# EAGLE design display (EAGLE 9.6.2)
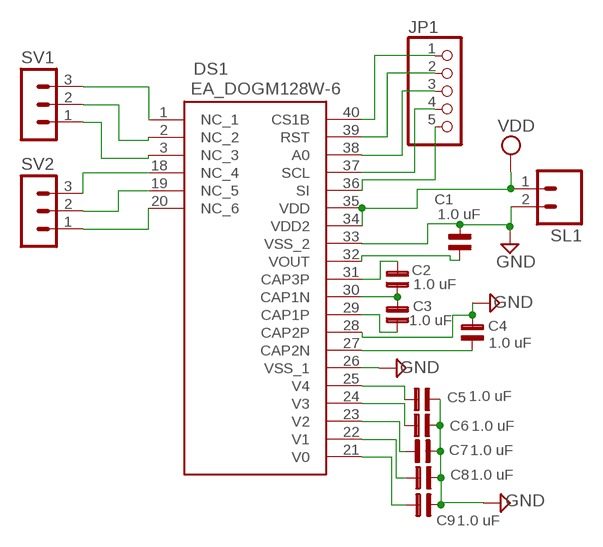
[diagram p0: schematic, sheet 1]

## Parts
C1  1.0 uF  C0805  [0805]
C2  1.0 uF  C0805  [0805]
C3  1.0 uF  C0805  [0805]
C4  1.0 uF  C0805  [0805]
C5  1.0 uF  C0805  [0805]
C6  1.0 uF  C0805  [0805]
C7  1.0 uF  C0805  [0805]
C8  1.0 uF  C0805  [0805]
C9  1.0 uF  C0805  [0805]
DS1  EA_DOGM128W-6  [EADOGM128W6]
JP1  PINHD-1X5  [1X05]
SL1  M02  [02P]
SV1  MA03-1  [MA03-1]
SV2  MA03-1  [MA03-1]

## Nets
GND: C1.2 C4.2 C5.2 C6.2 C7.2 C8.2 C9.2 DS1.26(VSS_1) DS1.28(CAP2P) DS1.33(VSS_2) SL1.2
N$1: C2.1 C3.2 DS1.30(CAP1N)
N$2: C2.2 DS1.31(CAP3P)
N$3: C3.1 DS1.29(CAP1P)
N$4: DS1.36(SI) JP1.5
N$5: C4.1 DS1.27(CAP2N)
N$6: C5.1 DS1.25(V4)
N$7: C6.1 DS1.24(V3)
N$8: C7.1 DS1.23(V2)
N$9: C8.1 DS1.22(V1)
N$10: C9.1 DS1.21(V0)
N$11: DS1.20(NC_6) SV2.1
N$12: DS1.19(NC_5) SV2.2
N$13: C1.1 DS1.32(VOUT)
N$14: DS1.18(NC_4) SV2.3
N$15: DS1.3(NC_3) SV1.1
N$16: DS1.2(NC_2) SV1.2
N$17: DS1.1(NC_1) SV1.3
N$18: DS1.37(SCL) JP1.4
N$19: DS1.38(A0) JP1.3
N$20: DS1.39(RST) JP1.2
N$21: DS1.40(CS1B) JP1.1
VDD: DS1.34(VDD2) DS1.35(VDD) SL1.1

## Library data of the parts
C1-C9 = capsmd:C0805
DS1 = SamacSys_Parts:EA_DOGM128W-6: Electronic Assembly EA DOGM128W-6 Graphic LCD Display, White on Black, Transflective Source: Datasheet <https://www.lcd-module.de/eng/pdf/grafik/dogm128e.pdf>; ARROW_PART_NUMBER: EA DOGM128W-6; DESCRIPTION: Electronic Assembly EA DOGM128W-6 Graphic LCD Display, White on Black, Transflective; HEIGHT: 2mm; MANUFACTURER_NAME: ELECTRONIC ASSEMBLY; MANUFACTURER_PART_NUMBER: EA DOGM128W-6; MOUSER_PART_NUMBER: 790-EADOGM128W6; MOUSER_PRICE-STOCK: https://www.mouser.co.uk/ProductDetail/ELECTRONIC-ASSEMBLY/EA-DOGM128W-6?qs=s9z6UkyjM7q3gza1hen1CQ%3D%3D
JP1 = pinhead:PINHD-1X5: PIN HEADER
SL1 = con-amp-quick:M02: AMP QUICK CONNECTOR; OC_FARNELL: unknown; OC_NEWARK: unknown
SV1 SV2 = con-lstb:MA03-1: PIN HEADER; OC_FARNELL: unknown; OC_NEWARK: unknown

## Board
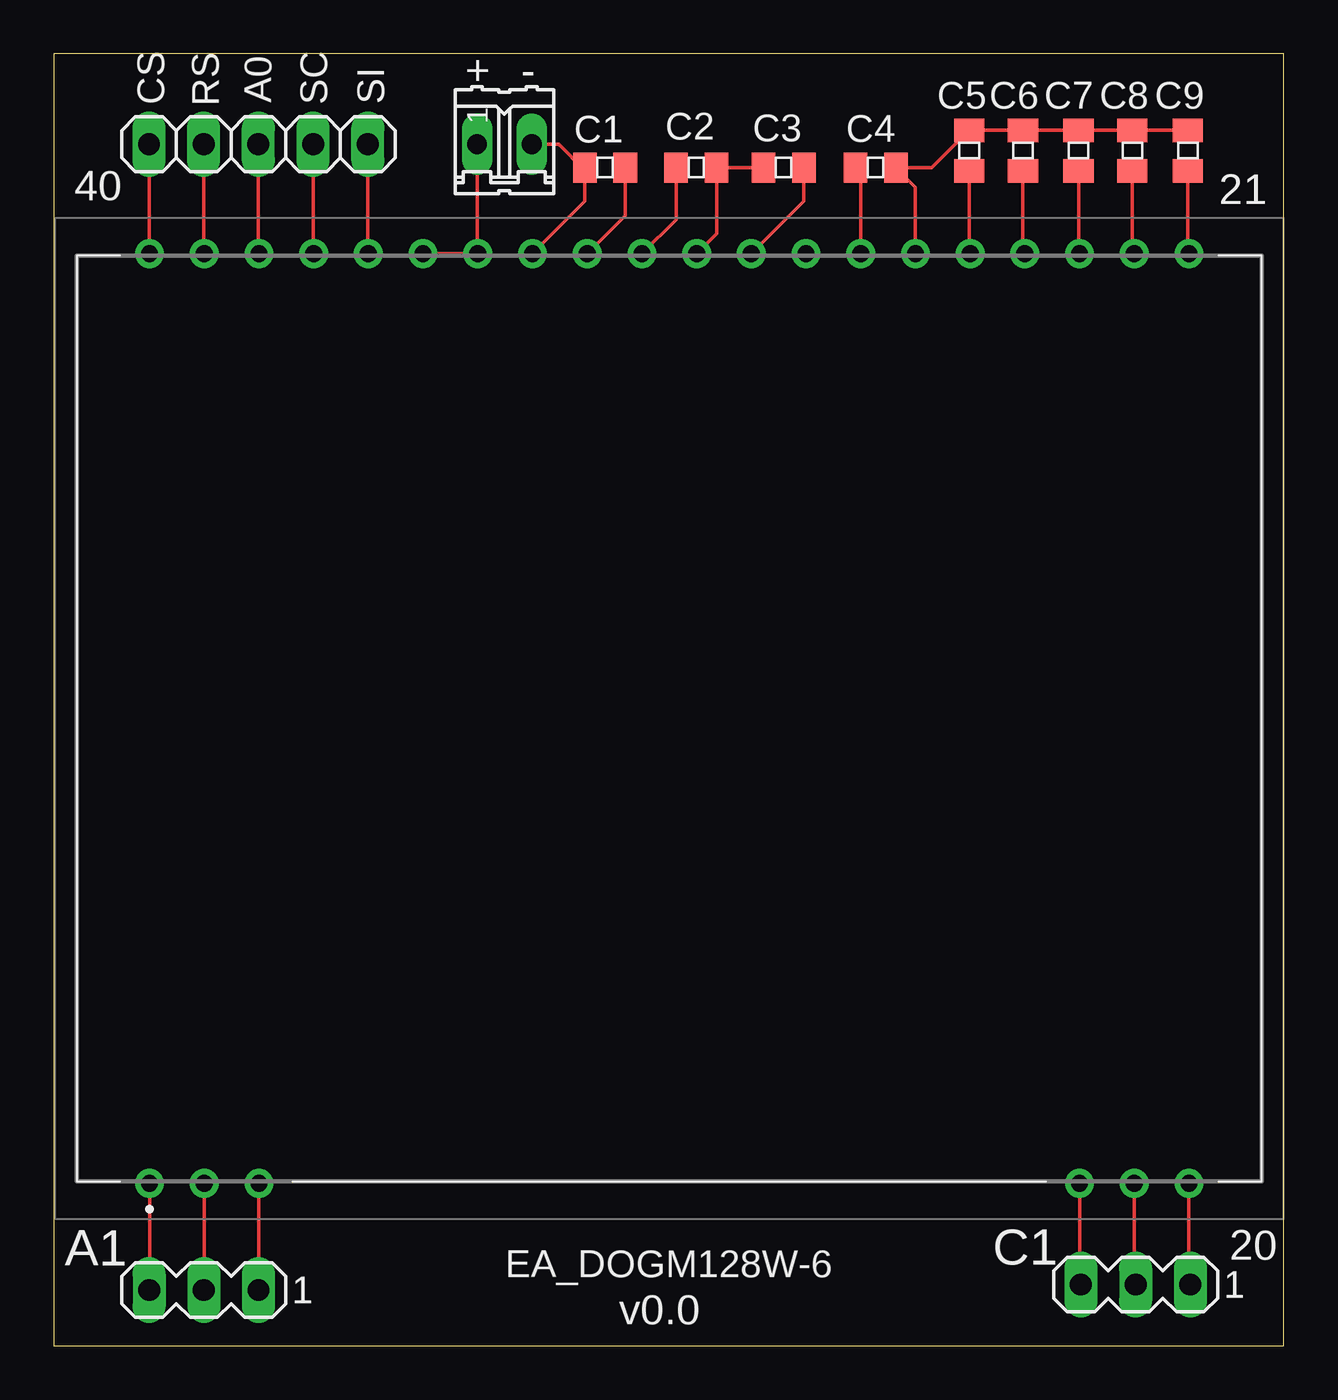
[diagram p1: board, top side]
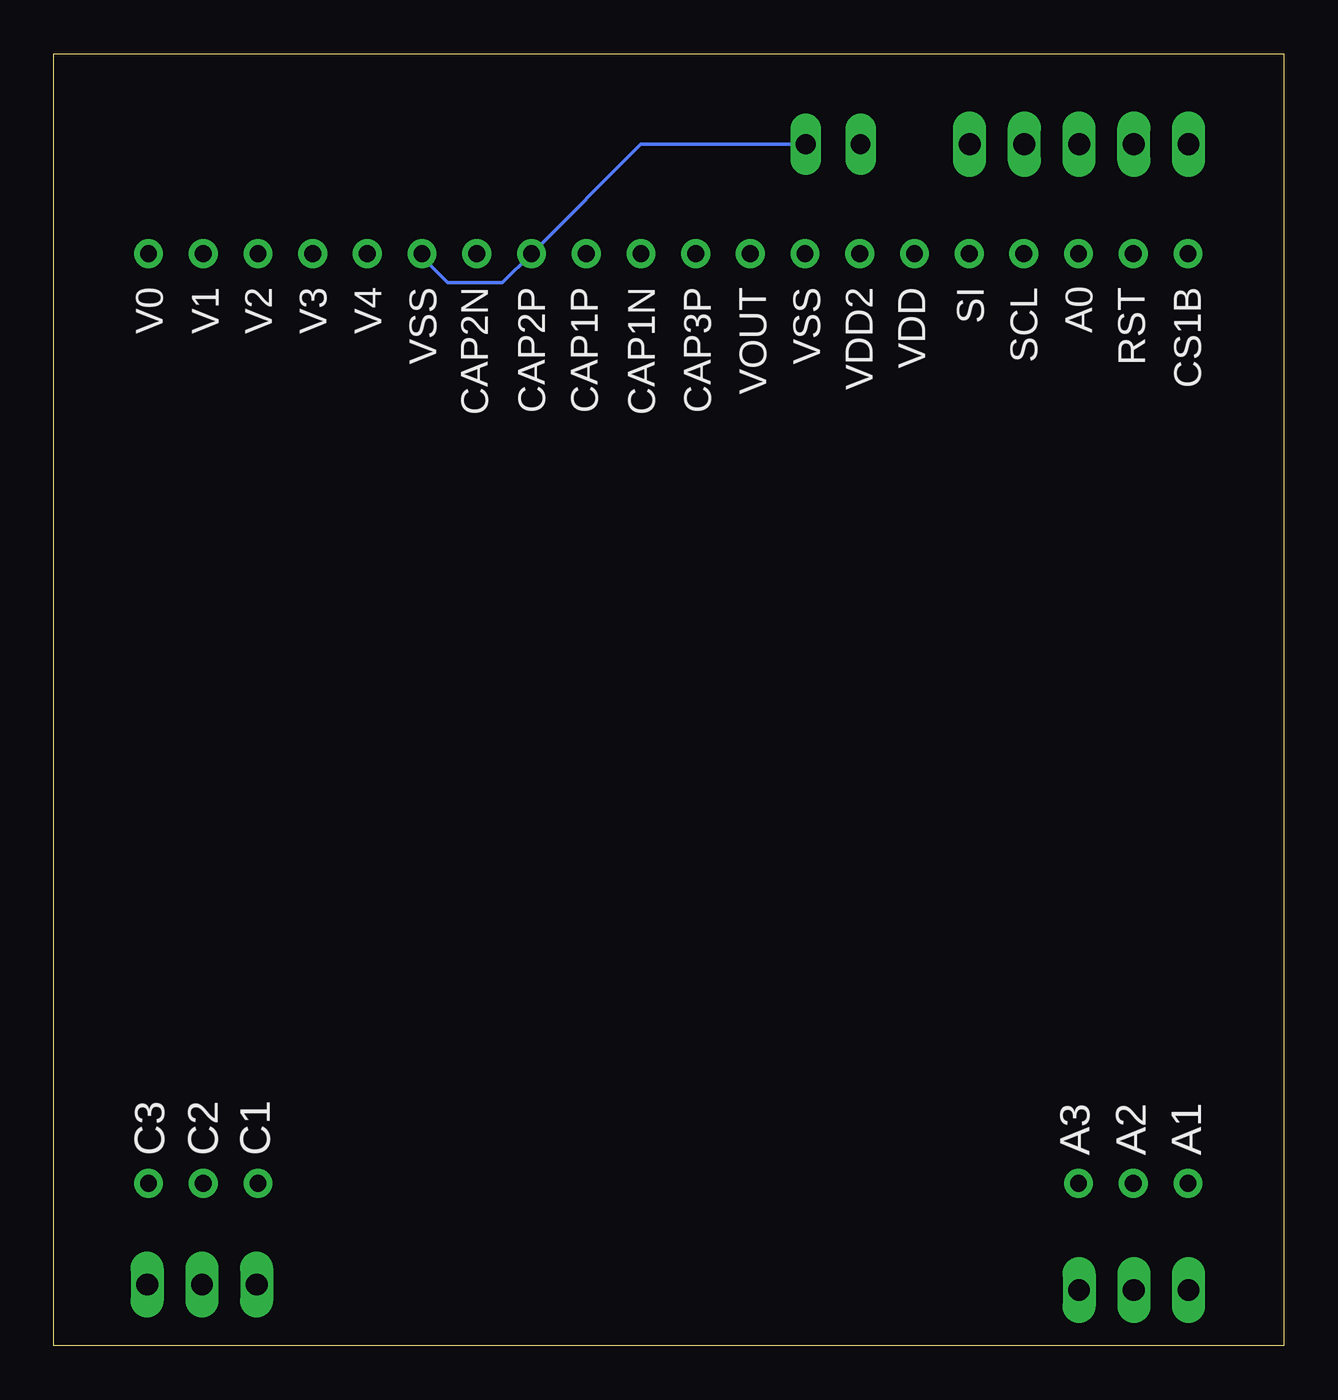
[diagram p2: board, bottom side, seen from below]

Size 57.1 x 60 mm. Coordinates in mm from the lower left corner, seen from the top.
Outline: 0,0 57.1,0 57.1,60 0,60 0,0
Copper layers (1*16): Top 0.035mm / dielectric 1.5mm / Bottom 0.035mm
Design rules "default": minimum track width 6mil, minimum drill 0.35mm, track to track 6mil, track to pad 6mil, pad to pad 6mil, via to via 6mil, smd to smd 6mil, copper to edge 40mil, drill to drill 6mil, minimum pad ring 10mil, minimum via ring 8mil, stop-mask expansion 4mil, vias tented up to drill 0mil, thermal gap 10mil

### Footprints (pad centres in the part's own frame; a part is rotated, then mirrored left to right if it is on the bottom)
0805 = smd 1.092 x 1.397: 1 -0.94,0; 2 0.94,0
EADOGM128W6 = drill 0.78 pad 1.337: 1 0,0; 2 2.54,0; 3 5.08,0; 18 43.18,0; 19 45.72,0; 20 48.26,0; 21 48.26,43.18; 22 45.72,43.18; 23 43.18,43.18; 24 40.64,43.18; 25 38.1,43.18; 26 35.56,43.18; 27 33.02,43.18; 28 30.48,43.18; 29 27.94,43.18; 30 25.4,43.18; 31 22.86,43.18; 32 20.32,43.18; 33 17.78,43.18; 34 15.24,43.18; 35 12.7,43.18; 36 10.16,43.18; 37 7.62,43.18; 38 5.08,43.18; 39 2.54,43.18; 40 0,43.18
1X05 = drill 1.016 long: 1 -5.08,0; 2 -2.54,0; 3 0,0; 4 2.54,0; 5 5.08,0
02P = drill 0.914 long: 1 -1.27,0; 2 1.27,0
MA03-1 = drill 1.016 long: 1 -2.54,0; 2 0,0; 3 2.54,0

### Placement (x,y rotation side)
C1  25.59,54.72 180 top
C2  29.83,54.72 180 top
C3  33.88,54.72 180 top
C4  38.15,54.72 0 top
C5  42.5,55.51 90 top
C6  45,55.51 90 top
C7  47.57,55.51 90 top
C8  50.08,55.51 90 top
C9  52.65,55.51 90 top
DS1  4.44,7.54 0 top
JP1  9.5,55.8 0 top
SL1  20.92,55.8 0 top
SV1  6.96,2.59 180 top
SV2  50.22,2.84 180 top

### Tracks (layer width: path | path; a pad name or v marks a point on that pad's centre or on a via)
GND
  Top 0.152: C9.2 C8.2 C7.2 C6.2 C5.2 40.77,54.72 C4.2 40,53.81 DS1.26 | SL1.2 23.43,55.8 24.65,54.58 C1.2 24.65,53.15 DS1.33
  Bottom 0.152: SL1.2 29.84,55.8 DS1.28 36.28,49.37 38.81,49.37 40,50.56 DS1.26
N$1
  Top 0.152: C3.2 C2.1 30.77,51.65 DS1.30
N$2
  Top 0.152: C2.2 28.89,52.31 DS1.31
N$3
  Top 0.152: C3.1 34.82,53.16 DS1.29
N$4
  Top 0.152: JP1.5 14.58,50.74 DS1.36
N$5
  Top 0.152: C4.1 37.46,54.47 DS1.27
N$6
  Top 0.152: C5.1 42.5,50.76 DS1.25
N$7
  Top 0.152: C6.1 44.99,50.81 DS1.24
N$8
  Top 0.152: C7.1 47.57,50.77 DS1.23
N$9
  Top 0.152: C8.1 50.07,50.81 DS1.22
N$10
  Top 0.152: C9.1 52.65,50.77 DS1.21
N$11
  Top 0.152: DS1.20 52.7,2.9 SV2.1
N$12
  Top 0.152: DS1.19 50.16,2.9 SV2.2
N$13
  Top 0.152: C1.1 26.53,52.49 DS1.32
N$14
  Top 0.152: DS1.18 47.62,2.9 SV2.3
N$15
  Top 0.152: DS1.3 9.52,2.61 SV1.1
N$16
  Top 0.152: DS1.2 6.98,2.61 SV1.2
N$17
  Top 0.152: DS1.1 4.44,2.61 SV1.3
N$18
  Top 0.152: JP1.4 12.04,50.74 DS1.37
N$19
  Top 0.152: JP1.3 9.5,50.74 DS1.38
N$20
  Top 0.152: JP1.2 6.96,50.74 DS1.39
N$21
  Top 0.152: JP1.1 4.42,50.74 DS1.40
VDD
  Top 0.152: SL1.1 19.65,50.76 DS1.34 DS1.35

### Text on the board
tPlace: + | - | CS | RS | A0 | SC | SI | 40 | 21 | A1 | C1 | 20 | v0.0
bPlace: CS1B | RST | A0 | SCL | SI | VDD | VDD2 | VSS | VOUT | CAP3P | CAP1N | CAP1P | CAP2P | CAP2N | VSS | V4 | V3 | V2 | V1 | V0 | A1 | A2 | A3 | C1 | C2 | C3